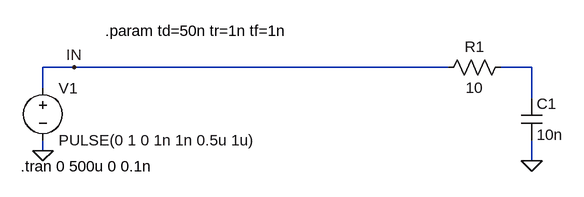
[diagram p0: schematic Single RC.asc]
Single RC.asc, the LTspice schematic file:
Version 4
SHEET 1 880 680
WIRE 64 160 16 160
WIRE 640 160 64 160
WIRE 768 160 720 160
WIRE 16 192 16 160
WIRE 768 208 768 160
WIRE 16 288 16 272
WIRE 768 304 768 272
FLAG 16 288 0
FLAG 64 160 IN
FLAG 768 304 0
SYMBOL voltage 16 176 R0
WINDOW 123 0 0 Left 0
WINDOW 39 0 0 Left 0
SYMATTR InstName V1
SYMATTR Value PULSE(0 1 0 1n 1n 0.5u 1u)
SYMBOL res 736 144 R90
WINDOW 0 0 56 VBottom 2
WINDOW 3 32 56 VTop 2
SYMATTR InstName R1
SYMATTR Value 10
SYMBOL cap 752 208 R0
SYMATTR InstName C1
SYMATTR Value 10n
TEXT -18 312 Left 2 !.tran 0 500u 0 0.1n
TEXT 112 104 Left 2 !.param td=50n tr=1n tf=1n

The netlist it stands for:
* Single RC.asc
V1 IN 0 PULSE(0 1 0 1n 1n 0.5u 1u)
R1 N001 IN 10
C1 N001 0 10n
.tran 0 500u 0 0.1n
.param td=50n tr=1n tf=1n
.backanno
.end